# EAGLE schematic esp8266 (EAGLE 9.6.2)
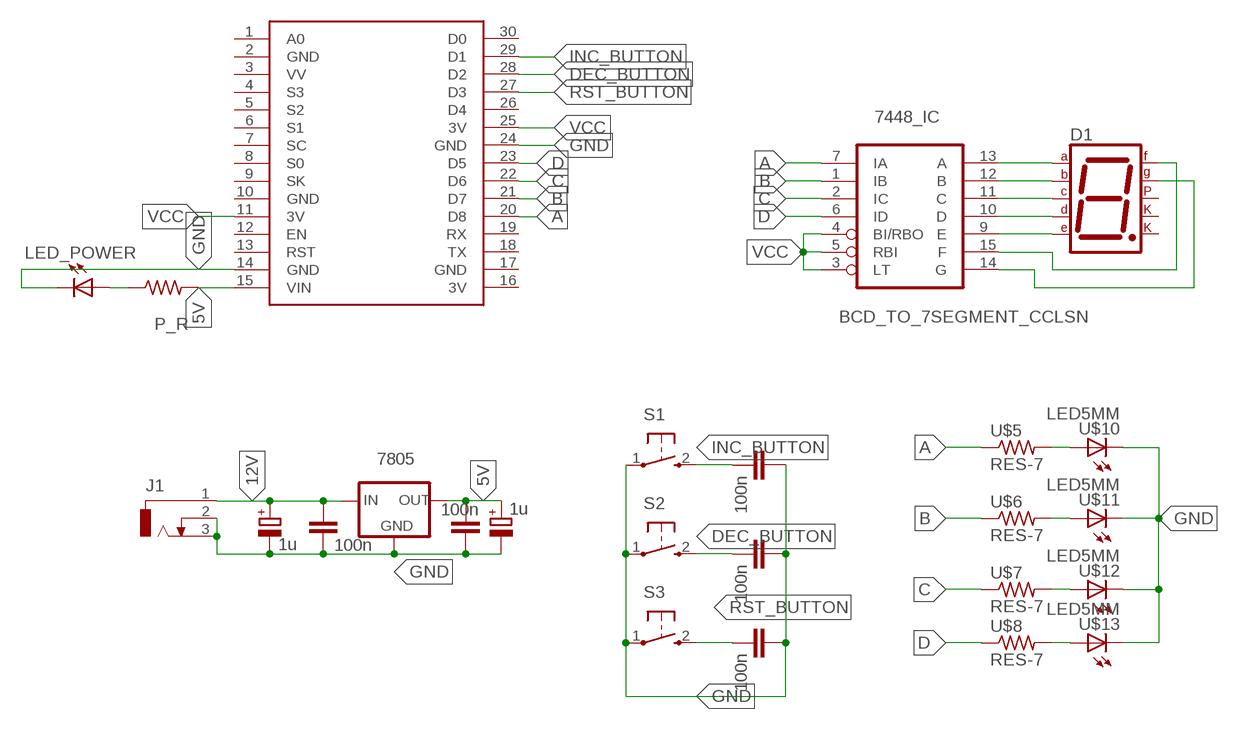
[diagram p0: schematic, sheet 1]

## Parts
7448_IC  BCD_TO_7SEGMENT_CCLSN  [DIL16]
7805  78XXS  [78XXS]
D1  7SEG-CK  [7SEG-13]
J1  CON_JACK  [DCJ0303]
LED_POWER  LED5MM  [LED5MM]
P_R  RES-7  [0204/7]
S1  PUSH_BUTTON  [B3F-10XX]
S2  PUSH_BUTTON  [B3F-10XX]
S3  PUSH_BUTTON  [B3F-10XX]
U$1  NODEMCU_V3  [NODEMCU]
U$2  100n  CAPACITOR  [C025-025X050]
U$3  100n  CAPACITOR  [C025-025X050]
U$4  100n  CAPACITOR  [C025-025X050]
U$5  RES-7  [0204/7]
U$6  RES-7  [0204/7]
U$7  RES-7  [0204/7]
U$8  RES-7  [0204/7]
U$10  LED5MM  [LED5MM]
U$11  LED5MM  [LED5MM]
U$12  LED5MM  [LED5MM]
U$13  LED5MM  [LED5MM]
U$15  1u  CAP_POL  [E3,5-8]
U$16  1u  CAP_POL  [E3,5-8]
U$17  100n  CAPACITOR  [C025-025X050]
U$18  100n  CAPACITOR  [C025-025X050]

## Nets
5V: 7805.OUT P_R.2 U$1.15(VIN) U$15.+ U$17.1
12V: 7805.IN J1.1 U$16.+ U$18.1
A: 7448_IC.7(IA) U$1.20(D8) U$5.1
B: 7448_IC.1(IB) U$1.21(D7) U$6.1
C: 7448_IC.2(IC) U$1.22(D6) U$7.1
D: 7448_IC.6(ID) U$1.23(D5) U$8.1
DEC_BUTTON: S2.2(S) U$1.28(D2) U$3.2
GND: 7805.GND J1.2 J1.3 LED_POWER.K(C) S1.1(P) S2.1(P) S3.1(P) U$1.14(GND) U$1.24(GND) U$2.1 U$3.1 U$4.1 U$10.K(C) U$11.K(C) U$12.K(C) U$13.K(C) U$15.- U$16.- U$17.2 U$18.2
INC_BUTTON: S1.2(S) U$1.29(D1) U$2.2
N$1: U$5.2 U$10.A
N$2: LED_POWER.A P_R.1
N$3: U$6.2 U$11.A
N$4: U$7.2 U$12.A
N$7: U$8.2 U$13.A
N$12: 7448_IC.11(C) D1.4(C)
N$13: 7448_IC.12(B) D1.6(B)
N$14: 7448_IC.13(A) D1.7(A)
N$15: 7448_IC.10(D) D1.2(D)
N$16: 7448_IC.9(E) D1.1(E)
N$17: 7448_IC.15(F) D1.9(F)
N$18: 7448_IC.14(G) D1.10(G)
RST_BUTTON: S3.2(S) U$1.27(D3) U$4.2
VCC: 7448_IC.3(LT) 7448_IC.4(BI/RBO) 7448_IC.5(RBI) U$1.11(3V) U$1.25(3V)
Unconnected: D1.3(CK1) D1.5(DP) D1.8(CK2) U$1.1(A0) U$1.3(VV) U$1.4(S3) U$1.5(S2) U$1.6(S1) U$1.7(SC) U$1.8(S0) U$1.9(SK) U$1.12(EN) U$1.13(RST) U$1.18(TX) U$1.19(RX) U$1.26(D4) U$1.30(D0)

## Power pins joined to a net without a drawn wire
3V: U$1.16(3V)
GND: 7448_IC.8(GND) U$1.2(GND) U$1.10(GND) U$1.17(GND)
VCC: 7448_IC.16(VCC)

## Library data of the parts
7448_IC = MIA_LIBRARY-2-2-2:BCD_TO_7SEGMENT_CC: BCD to seven segment DECODER/DRIVER
7805 = MIA_LIBRARY-2-2-2:78XXS: VOLTAGE REGULATOR
D1 = MIA_LIBRARY-2-2-2:7SEG-CK: 7-segment DISPLAY single cathode, 13 mm
J1 = MIA_LIBRARY-2-2-2:CON_JACK: DC POWER JACK Source: DCJ0303.pdf; OC_FARNELL: unknown; OC_NEWARK: unknown
LED_POWER U$10-U$13 = MIA_LIBRARY-2-2-2:LED5MM
P_R U$5-U$8 = MIA_LIBRARY-2-2-2:RES-7
S1-S3 = MIA_LIBRARY-2-2-2:PUSH_BUTTON: OMRON SWITCH
U$1 = MIA_LIBRARY-2-2-2:NODEMCU_V3
U$2-U$4 U$17 U$18 = MIA_LIBRARY-2-2-2:CAPACITOR
U$15 U$16 = MIA_LIBRARY-2-2-2:CAP_POL